# EAGLE design Schematic (EAGLE 9.2.0)
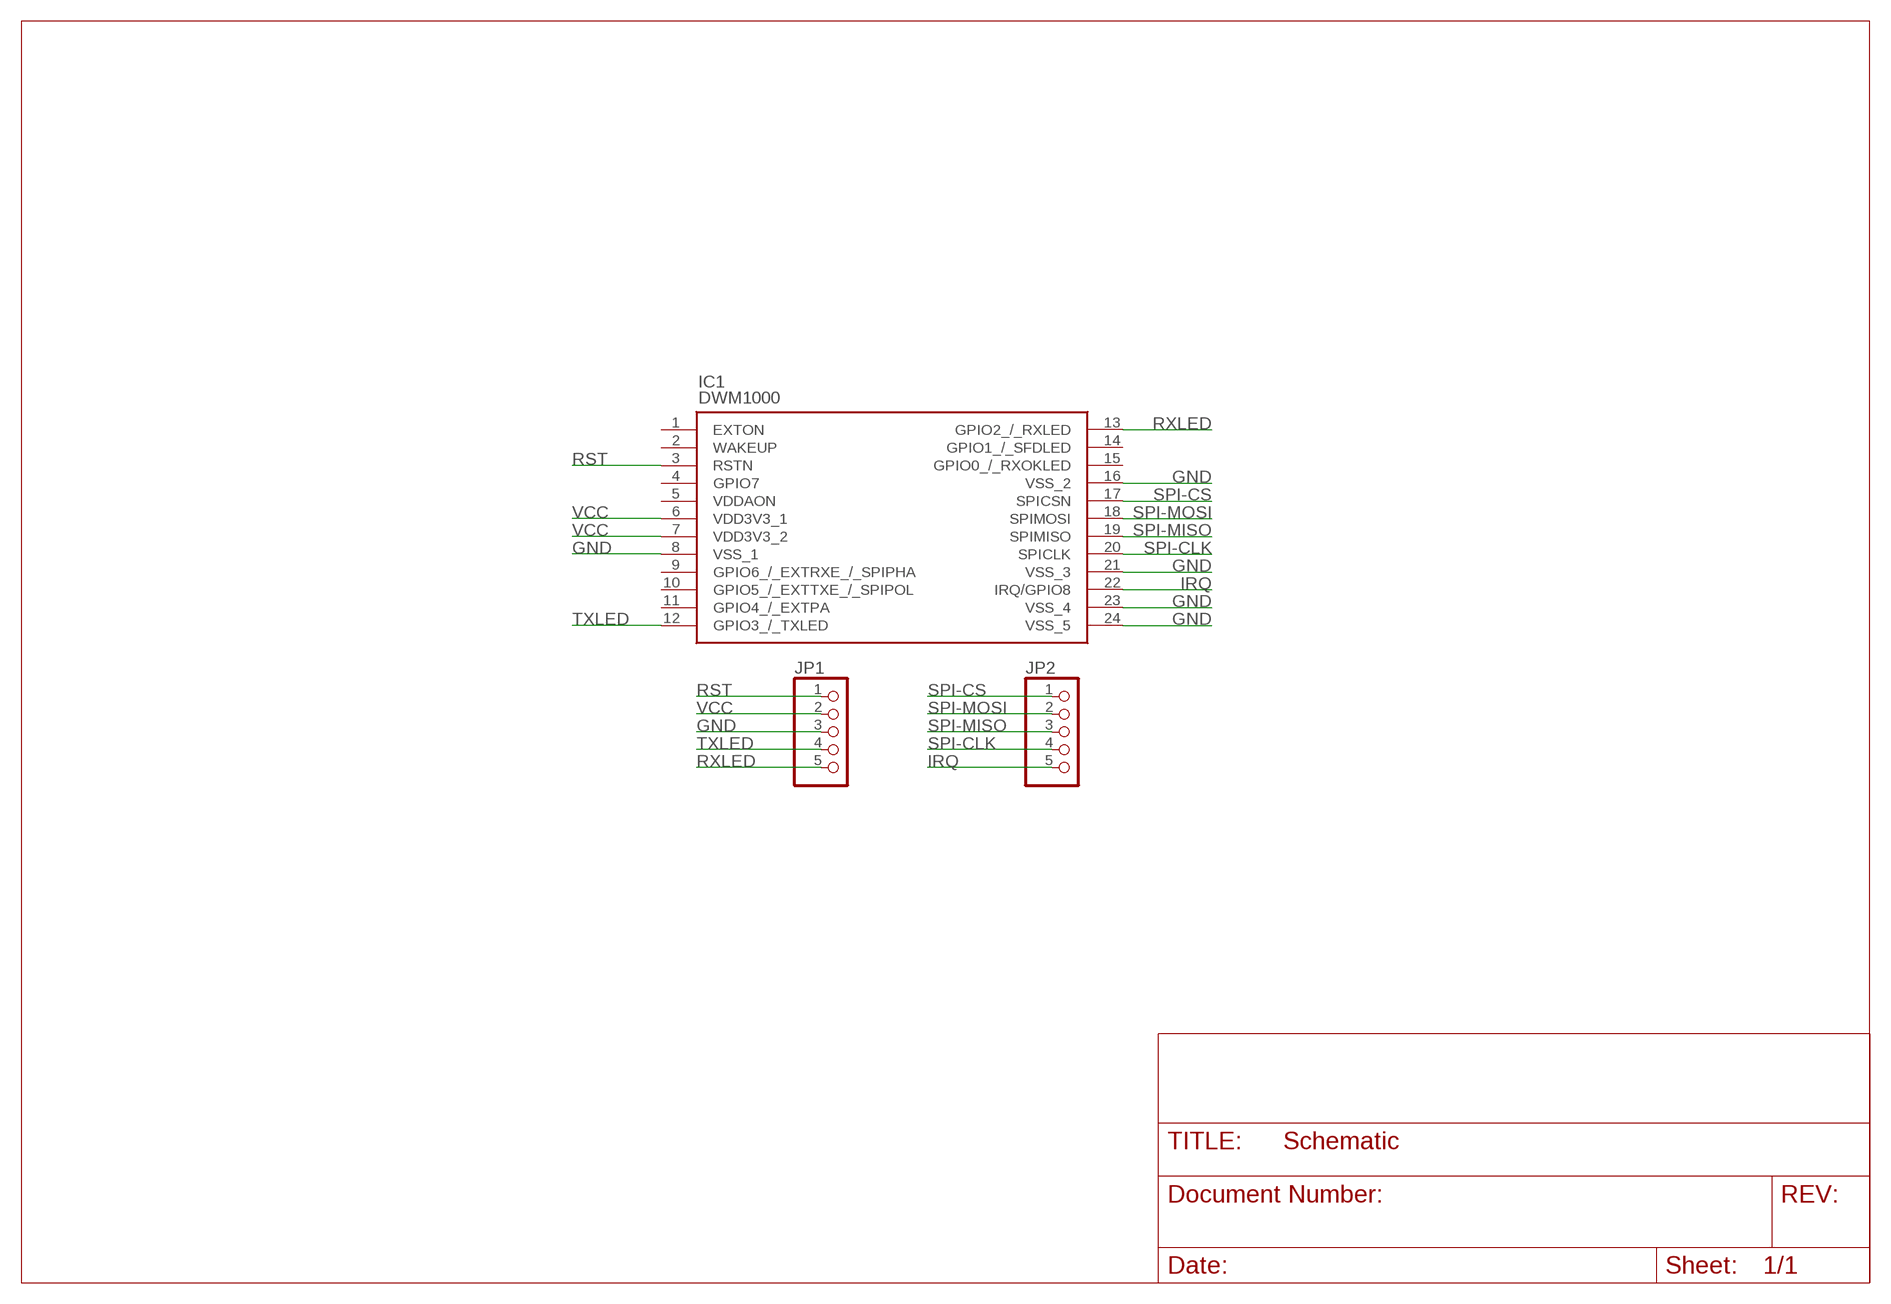
[diagram p0: schematic, sheet 1]

## Parts
IC1  DWM1000  [DWM1000]
JP1  PINHD-1X5  [1X05]
JP2  PINHD-1X5  [1X05]

## Nets
GND: IC1.8(VSS_1) IC1.16(VSS_2) IC1.21(VSS_3) IC1.23(VSS_4) IC1.24(VSS_5) JP1.3
IRQ: IC1.22(IRQ/GPIO8) JP2.5
RST: IC1.3(RSTN) JP1.1
RXLED: IC1.13(GPIO2_/_RXLED) JP1.5
SPI-CLK: IC1.20(SPICLK) JP2.4
SPI-CS: IC1.17(SPICSN) JP2.1
SPI-MISO: IC1.19(SPIMISO) JP2.3
SPI-MOSI: IC1.18(SPIMOSI) JP2.2
TXLED: IC1.12(GPIO3_/_TXLED) JP1.4
VCC: IC1.6(VDD3V3_1) IC1.7(VDD3V3_2) JP1.2
Unconnected: IC1.1(EXTON) IC1.2(WAKEUP) IC1.4(GPIO7) IC1.5(VDDAON) IC1.9(GPIO6_/_EXTRXE_/_SPIPHA) IC1.10(GPIO5_/_EXTTXE_/_SPIPOL) IC1.11(GPIO4_/_EXTPA) IC1.14(GPIO1_/_SFDLED) IC1.15(GPIO0_/_RXOKLED)

## Library data of the parts
IC1 = DWM1000:DWM1000: IEEE 802.15.4-2011 UWB Transceiver Module Source: Datasheet <http://www.decawave.com/sites/default/files/resources/dwm1000-datasheet-v1.3.pdf>; ARROW_PART_NUMBER: DWM1000; DESCRIPTION: IEEE 802.15.4-2011 UWB Transceiver Module; HEIGHT: mm; MANUFACTURER_NAME: Decawave; MANUFACTURER_PART_NUMBER: DWM1000
JP1 JP2 = pinhead:PINHD-1X5: PIN HEADER

## Board
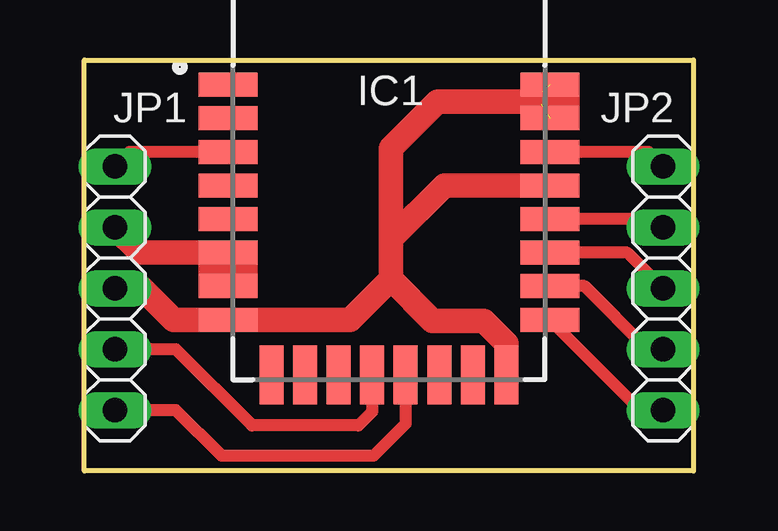
[diagram p1: board, top side]

Size 25.4 x 17.14 mm. Coordinates in mm from the lower left corner, seen from the top.
Outline: 0,17.14 25.4,17.14 25.4,0 0,0 0,17.14
Copper layers (1*16): Top 0.035mm / dielectric 1.5mm / Bottom 0.035mm
Design rules "default": minimum track width 6mil, minimum drill 0.35mm, track to track 6mil, track to pad 6mil, pad to pad 6mil, via to via 6mil, smd to smd 6mil, copper to edge 40mil, drill to drill 6mil, minimum pad ring 10mil, minimum via ring 8mil, stop-mask expansion 4mil, vias tented up to drill 0mil, thermal gap 10mil

### Footprints (pad centres in the part's own frame; a part is rotated, then mirrored left to right if it is on the bottom)
DWM1000 = smd 2.45 x 1: 1 -6.705,12.3; 2 -6.705,10.9; 3 -6.705,9.5; 4 -6.705,8.1; 5 -6.705,6.7; 6 -6.705,5.3; 7 -6.705,3.9; 8 -6.705,2.5; 17 6.705,2.5; 18 6.705,3.9; 19 6.705,5.3; 20 6.705,6.7; 21 6.705,8.1; 22 6.705,9.5; 23 6.705,10.9; 24 6.705,12.3 | smd 1 x 2.45: 9 -4.9,0.205; 10 -3.5,0.205; 11 -2.1,0.205; 12 -0.7,0.205; 13 0.7,0.205; 14 2.1,0.205; 15 3.5,0.205; 16 4.9,0.205
1X05 = drill 1.016 long: 1 -5.08,0; 2 -2.54,0; 3 0,0; 4 2.54,0; 5 5.08,0

### Placement (x,y rotation side)
IC1  12.7,3.81 0 top
JP1  1.27,7.62 270 top
JP2  24.13,7.62 90 top

### Tracks (layer width: path | path; a pad name or v marks a point on that pad's centre or on a via)
GND  (2 unrouted)
  Top 1.016: JP1.3 2.42,7.62 3.73,6.31 IC1.8 11.08,6.31 12.78,8.01 | IC1.16 17.6,5.33 16.66,6.27 14.52,6.27 12.78,8.01 | 12.79,9.69 12.79,8.02 12.78,8.01 | IC1.21 15.01,11.91 12.79,9.69 | 12.79,9.69 12.79,13.47 14.72,15.4 19.1,15.4 | 19.1,15.81 19.1,15.4 | 19.1,15.4 19.03,15.33
IRQ
  Top 0.508: IC1.22 23.52,13.31 JP2.5
RST
  Top 0.508: JP1.1 1.88,13.31 IC1.3
RXLED
  Top 0.508: JP1.5 3.81,2.54 5.71,0.64 12.07,0.64 13.4,1.97 IC1.13
SPI-CLK
  Top 0.508: IC1.20 23.78,10.51 JP2.4
SPI-CS
  Top 0.508: IC1.17 23.18,2.54 JP2.1
SPI-MISO
  Top 0.508: IC1.19 22.64,9.11 JP2.3
SPI-MOSI
  Top 0.508: IC1.18 20.87,7.71 23.5,5.08 JP2.2
TXLED
  Top 0.508: IC1.12 12,2.48 11.43,1.91 6.99,1.91 3.81,5.08 JP1.4
VCC
  Top 0.508: IC1.6 5.71,9.11
  Top 0.813: IC1.7 5.71,7.71 5.71,9.11 | IC1.6 IC1.7 | IC1.7 6.35,7.71 6.35,8.89
  Top 1.016: JP1.2 2.32,9.11 IC1.6
(copper drawn outside any net)
  shapes: Top area x2